# EAGLE design LED_letter_H (EAGLE 8.0.0)
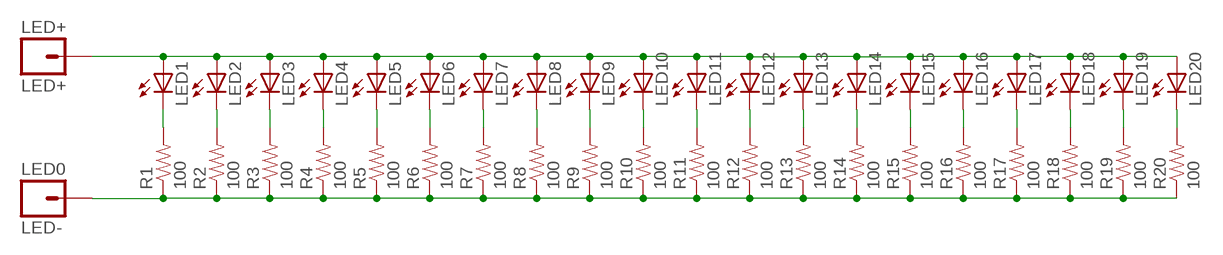
[diagram p0: schematic, sheet 1]

## Parts
LED0  LED-  M01OFFSET  [1X01_OFFSET]
LED1  LED5MM  [LED5MM]
LED2  LED5MM  [LED5MM]
LED3  LED5MM  [LED5MM]
LED4  LED5MM  [LED5MM]
LED5  LED5MM  [LED5MM]
LED6  LED5MM  [LED5MM]
LED7  LED5MM  [LED5MM]
LED8  LED5MM  [LED5MM]
LED9  LED5MM  [LED5MM]
LED10  LED5MM  [LED5MM]
LED11  LED5MM  [LED5MM]
LED12  LED5MM  [LED5MM]
LED13  LED5MM  [LED5MM]
LED14  LED5MM  [LED5MM]
LED15  LED5MM  [LED5MM]
LED16  LED5MM  [LED5MM]
LED17  LED5MM  [LED5MM]
LED18  LED5MM  [LED5MM]
LED19  LED5MM  [LED5MM]
LED20  LED5MM  [LED5MM]
LED+  LED+  M01OFFSET  [1X01_OFFSET]
R1  100  RESISTORPTH-1/6W  [1/6W-RES]
R2  100  RESISTORPTH-1/6W  [1/6W-RES]
R3  100  RESISTORPTH-1/6W  [1/6W-RES]
R4  100  RESISTORPTH-1/6W  [1/6W-RES]
R5  100  RESISTORPTH-1/6W  [1/6W-RES]
R6  100  RESISTORPTH-1/6W  [1/6W-RES]
R7  100  RESISTORPTH-1/6W  [1/6W-RES]
R8  100  RESISTORPTH-1/6W  [1/6W-RES]
R9  100  RESISTORPTH-1/6W  [1/6W-RES]
R10  100  RESISTORPTH-1/6W  [1/6W-RES]
R11  100  RESISTORPTH-1/6W  [1/6W-RES]
R12  100  RESISTORPTH-1/6W  [1/6W-RES]
R13  100  RESISTORPTH-1/6W  [1/6W-RES]
R14  100  RESISTORPTH-1/6W  [1/6W-RES]
R15  100  RESISTORPTH-1/6W  [1/6W-RES]
R16  100  RESISTORPTH-1/6W  [1/6W-RES]
R17  100  RESISTORPTH-1/6W  [1/6W-RES]
R18  100  RESISTORPTH-1/6W  [1/6W-RES]
R19  100  RESISTORPTH-1/6W  [1/6W-RES]
R20  100  RESISTORPTH-1/6W  [1/6W-RES]

## Nets
+: LED1.A LED2.A LED3.A LED4.A LED5.A LED6.A LED7.A LED8.A LED9.A LED10.A LED11.A LED12.A LED13.A LED14.A LED15.A LED16.A LED17.A LED18.A LED19.A LED20.A LED+.1
-: LED0.1 R1.1 R2.1 R3.1 R4.1 R5.1 R6.1 R7.1 R8.1 R9.1 R10.1 R11.1 R12.1 R13.1 R14.1 R15.1 R16.1 R17.1 R18.1 R19.1 R20.1
N$1: LED1.K(C) R1.2
N$5: LED20.K(C) R20.2
N$6: LED19.K(C) R19.2
N$7: LED18.K(C) R18.2
N$8: LED17.K(C) R17.2
N$9: LED16.K(C) R16.2
N$10: LED15.K(C) R15.2
N$11: LED14.K(C) R14.2
N$12: LED13.K(C) R13.2
N$13: LED12.K(C) R12.2
N$14: LED11.K(C) R11.2
N$15: LED10.K(C) R10.2
N$16: LED9.K(C) R9.2
N$17: LED8.K(C) R8.2
N$18: LED7.K(C) R7.2
N$19: LED6.K(C) R6.2
N$20: LED5.K(C) R5.2
N$21: LED4.K(C) R4.2
N$22: LED3.K(C) R3.2
N$23: LED2.K(C) R2.2

## Library data of the parts
LED0 LED+ = SparkFun:M01: Header 1 Standard 1-pin 0.1" header. Use with straight break away headers (SKU : PRT-00116), right angle break away headers (PRT-00553), swiss pins (PRT-00743), machine pins (PRT-00117), and female headers (PRT-00115).
LED1-LED20 = adafruit-2014:LED: LED OSRAM: - CHIPLED LG R971, LG N971, LY N971, LG Q971, LY Q971, LO R971, LY R971 LH N974, LH R974 LS Q976, LO Q976, LY Q976 LO Q996 - Hyper CHIPLED LW Q18S LB Q993, LB Q99A, LB R99A - SideLED LS A670, LO A670, LY A670, LG A670, LP A670 LB A673, LV A673, LT A673, LW A673 LH A674 LY A675 LS A676, LA A676, LO A676, LY A676, LW A676 LS A679, LY A679, LG A679 - Hyper Micro SIDELED® LS Y876, LA Y876, LO Y876, LY Y876 LT Y87S - SmartLED LW L88C, LW L88S LB L89C, LB L89S, LG L890 LS L89K, LO L89K, LY L89K LS L896, LA L896, LO L896, LY L896 - TOPLED LS T670, LO T670, LY T670, LG T670, LP T670 LSG T670, LSP T670, LSY T670, LOP T670, LYG T670 LG T671, LOG T671, LSG T671 LB T673, LV T673, LT T673, LW T673 LH T674 LS T676, LA T676, LO T676, LY T676, LB T676, LH T676, LSB T676, LW T676 LB T67C, LV T67C, LT T67C, LS T67K, LO T67K, LY T67K, LW E67C LS E67B, LA E67B, LO E67B, LY E67B, LB E67C, LV E67C, LT E67C LW T67C LS T679, LY T679, LG T679 LS T770, LO T770, LY T770, LG T770, LP T770 LB T773, LV T773, LT T773, LW T773 LH T774 LS E675, LA E675, LY E675, LS T675 LS T776, LA T776, LO T776, LY T776, LB T776 LHGB T686 LT T68C, LB T68C - Hyper Mini TOPLED® LB M676 - Mini TOPLED Santana® LG M470 LS M47K, LO M47K, LY M47K Source: http://www.osram.convergy.de/
R1-R20 = SparkFun:RESISTOR: Resistor Basic schematic elements and footprints for 0603, 1206, and PTH 1/10th watt (small) resistors.

## Board
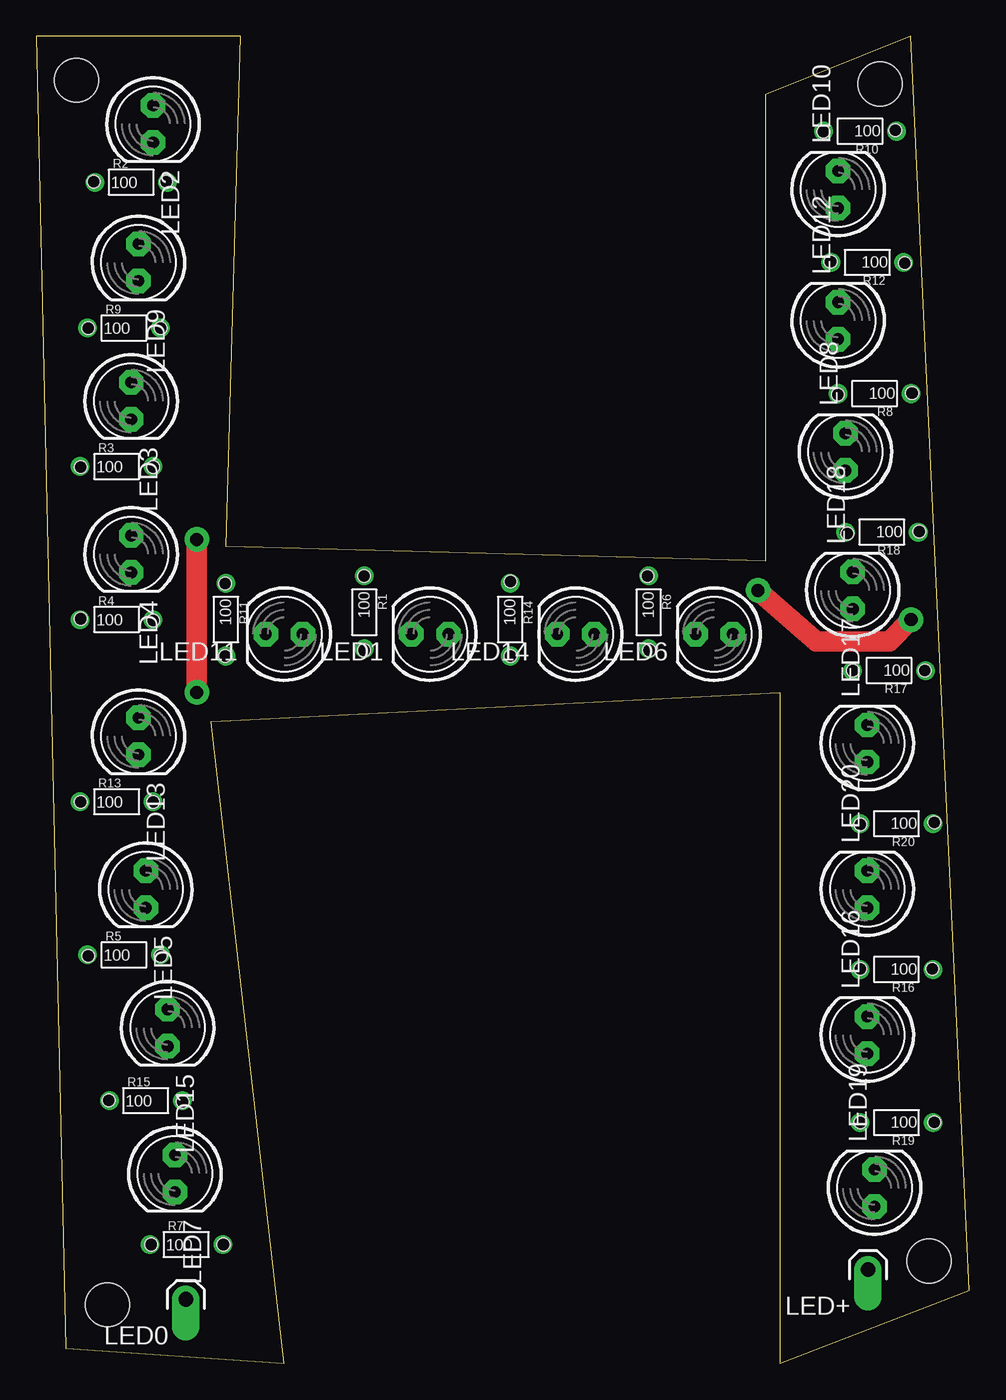
[diagram p1: board, top side]
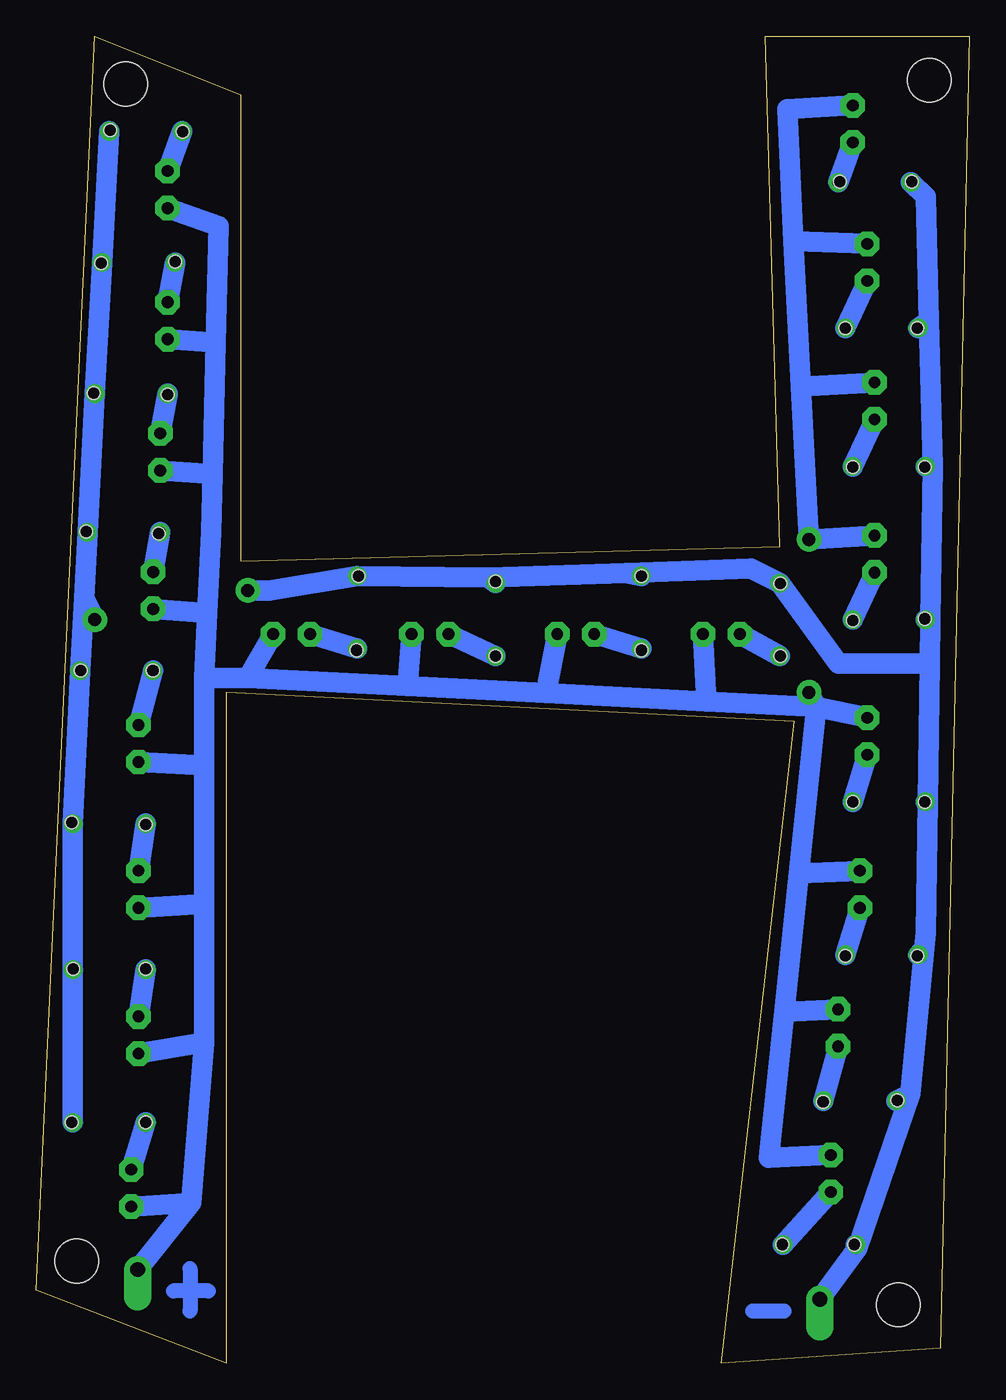
[diagram p2: board, bottom side, seen from below]

Size 64 x 91 mm. Coordinates in mm from the lower left corner, seen from the top.
Outline: 2,1 17,0 12,44 51,46 51,0 64,5 60,91 50,87 50,55 13,56 14,91 0,91 2,1
Copper layers (1*16): Top 0.035mm / dielectric 1.5mm / Bottom 0.035mm
Design rules "default": minimum track width 10mil, minimum drill 24mil, track to track 8mil, track to pad 8mil, pad to pad 8mil, via to via 8mil, smd to smd 8mil, copper to edge 40mil, drill to drill 8mil, minimum pad ring 10mil, minimum via ring 8mil, stop-mask expansion 4mil, vias tented up to drill 0mil, thermal gap 10mil
Holes 3 mm at 2.75,88 57.87,87.75 61.24,7 4.87,4
Holes 0.86 mm at 7.87,8.13 12.83,8.13 10.03,17.91 4.95,18.03 8.51,27.94 3.56,27.94 8,38.48 3.05,38.48 8,50.93 3.05,51.05 8,61.47 3.05,61.47 8.51,70.99 3.56,70.99 8.89,81.03 3.94,81.03 12.95,48.51 12.95,53.47 22.48,53.98 22.48,48.9 32.51,48.51 32.51,53.59 41.91,53.98 42.04,48.9 56.01,47.5 60.96,47.5 60.58,57.02 55.63,56.9 54.99,66.42 60.07,66.55 54.48,75.56 59.56,75.44 58.93,84.58 53.98,84.45 56.52,16.51 61.59,16.51 61.47,27.05 56.52,27.05 56.52,36.96 61.59,37.08

### Footprints (pad centres in the part's own frame; a part is rotated, then mirrored left to right if it is on the bottom)
1X01_OFFSET = drill 1.016 pad 1.88 offset: 1 0,0
LED5MM = drill 0.813 pad 1.676 octagon: A -1.27,0; K 1.27,0
1/6W-RES = drill 0.762: 1 -2.5,0; 2 2.5,0

### Placement (x,y rotation side)
LED0  10.25,4.38 180 top
LED1  27,50 180 top
LED2  8,85 270 top
LED3  6.5,66 270 top
LED4  6.5,55.5 270 top
LED5  7.5,32.5 270 top
LED6  46.5,50 180 top
LED7  9.5,13 270 top
LED8  55.5,62.5 90 top
LED9  7,75.5 270 top
LED10  55,80.5 90 top
LED11  17,50 180 top
LED12  55,71.5 90 top
LED13  7,43 270 top
LED14  37,50 180 top
LED15  9,23 270 top
LED16  57,22.5 90 top
LED17  57,42.5 90 top
LED18  56,53 90 top
LED19  57.5,12 90 top
LED20  57,32.5 90 top
LED+  57.05,6.41 180 top
R1  22.5,51.5 270 top
R2  6.5,81 0 top
R3  5.5,61.5 0 top
R4  5.5,51 0 top
R5  6,28 0 top
R6  42,51.5 270 top
R7  10.28,8.13 0 top
R8  57.5,66.5 180 top
R9  6,71 0 top
R10  56.5,84.5 180 top
R11  13,51 270 top
R12  57,75.5 180 top
R13  5.5,38.5 0 top
R14  32.5,51 270 top
R15  7.5,18 0 top
R16  59,27 180 top
R17  58.5,47.5 180 top
R18  58,57 180 top
R19  59,16.5 180 top
R20  59,37 180 top

### Tracks (layer width: path | path; a pad name or v marks a point on that pad's centre or on a via)
+  (via drill 0.9 pad 1.68)
  Top 1.422: v11,46 v11,56.5
  Bottom 1.422: 12.7,24.07 13.76,14.08 LED7.A | 11.7,33.57 12.7,24.07 | 10.5,45 11.7,33.57 | LED2.A 12.5,86 12.06,76.97 | 12.06,76.97 11.54,66.97 | 11.54,66.97 v11,56.5 LED4.A | LED3.A 11.54,66.97 | LED9.A 12.06,76.97 | LED15.A 12.7,24.07 | LED5.A 11.7,33.57 | 29.03,45.95 38.53,46.44 | 18.03,45.39 29.03,45.95 | 18.03,45.39 10.5,45 | 38.53,46.44 49.5,47 | 49.5,47 LED6.A | LED14.A 38.53,46.44 | LED1.A 29.03,45.95 | LED11.A 18.03,45.39 | 10.5,45 v11,46 | LED13.A 10.5,45 | 52.5,47 49.5,47 | 52.5,31.5 52.5,22 | 52.5,41 52.5,31.5 | 52.5,41 52.5,47 | 53.39,11 52.5,22 | 53.39,11 LED19.A | LED16.A 52.5,22 | LED20.A 52.5,31.5 | LED17.A 52.5,41 | LED10.A 51.5,78 51.69,69.98 | 51.69,69.98 51.91,60.99 | 51.91,60.99 52,57 52.28,51.46 | LED8.A 51.91,60.99 | LED12.A 51.69,69.98 | 52.28,51.46 52.5,47 | LED18.A 52.28,51.46 | LED+.1 53.39,11
-  (via drill 0.9 pad 1.68)
  Top 1.422: v49.5,53 53.5,49.5 58.5,49.5 v60,51
  Bottom 1.422: R2.1 3,80 2.77,71.52 | 2.5,61.5 2.77,71.52 | 2.66,50.99 2.5,61.5 | 2.71,47.99 2.86,38.49 | 2.71,47.99 2.66,50.99 | 2.86,38.49 3,29.5 3.1,28.46 | 4.05,18.46 3.1,28.46 | 7.67,7.87 4.05,18.46 | 7.67,7.87 LED0.1 | R9.1 2.77,71.52 | R3.1 2.5,61.5 | R4.1 2.66,50.99 | R13.1 2.86,38.49 | R5.1 3.1,28.46 | R15.1 4.05,18.46 | R7.1 7.67,7.87 | 23.52,54.21 33.01,53.88 | 23.52,54.21 15,54.5 R11.1 9,48 2.71,47.99 | 33.01,53.88 R6.1 48,53 v49.5,53 | R14.1 33.01,53.88 | R1.1 23.52,54.21 | R10.1 R12.1 R8.1 R18.1 60.74,52.49 | 60.74,52.49 R17.1 R20.1 R16.1 R19.1 | v60,51 60.74,52.49
N$1
  Bottom 1.422: R1.2 LED1.K
N$2
  Bottom 1.016: 12.7,3.56 14.86,3.56
N$3
  Bottom 1.016: 52.2,4.95 54.61,4.95
N$4
  Bottom 1.016: 53.47,6.48 53.47,3.56
N$5
  Bottom 1.422: LED20.K R20.2
N$6
  Bottom 1.422: R19.2 LED19.K
N$7
  Bottom 1.422: R18.2 LED18.K
N$8
  Bottom 1.422: LED17.K R17.2
N$9
  Bottom 1.422: LED16.K R16.2
N$10
  Bottom 1.422: R15.2 LED15.K
N$11
  Bottom 1.422: R14.2 LED14.K
N$12
  Bottom 1.422: R13.2 LED13.K
N$13
  Bottom 1.422: R12.2 LED12.K
N$14
  Bottom 1.422: R11.2 LED11.K
N$15
  Bottom 1.422: R10.2 LED10.K
N$16
  Bottom 1.422: R9.2 LED9.K
N$17
  Bottom 1.422: R8.2 LED8.K
N$18
  Bottom 1.422: R7.2 LED7.K
N$19
  Bottom 1.422: R6.2 LED6.K
N$20
  Bottom 1.422: R5.2 LED5.K
N$21
  Bottom 1.422: R4.2 LED4.K
N$22
  Bottom 1.422: R3.2 LED3.K
N$23
  Bottom 1.422: R2.2 LED2.K